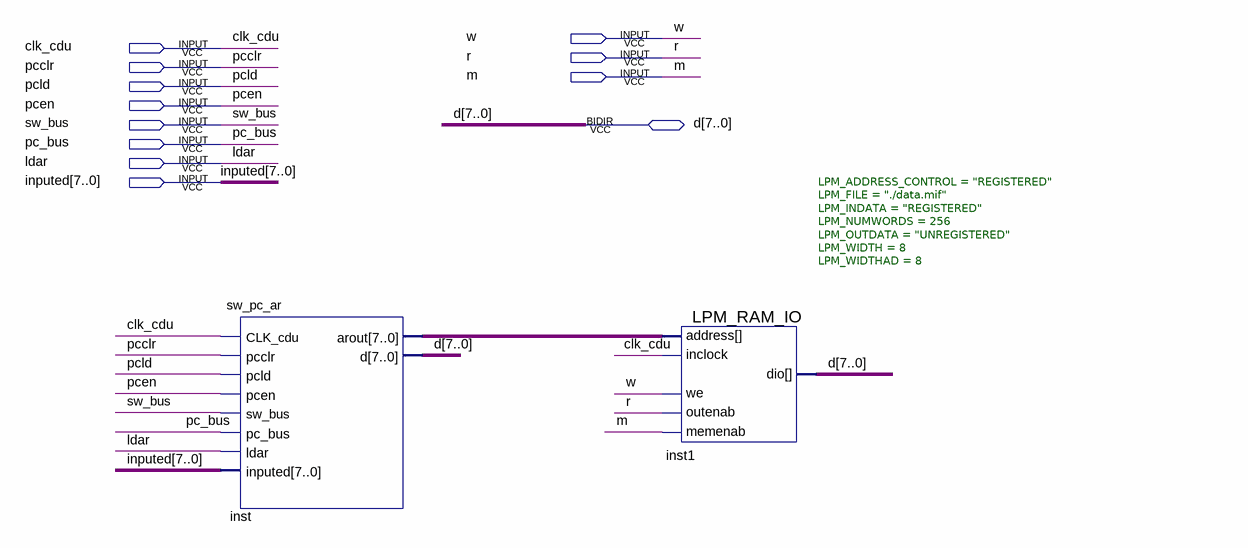
[diagram p0: schematic sheet]
// Quartus schematic ram1.bdf as structural Verilog: 2 symbols, 12 pins
module ram1 (
  input  w,
  input  clk_cdu,
  input  r,
  input  pcclr,
  input  m,
  input  pcld,
  input  pcen,
  input  sw_bus,
  input  pc_bus,
  input  ldar,
  input  [7:0] inputed,
  inout  [7:0] d
);

  wire [7:0] inst_arout;

  sw_pc_ar inst (
    .CLK_cdu(clk_cdu), .pcclr(pcclr), .pcld(pcld), .pcen(pcen), .sw_bus(sw_bus), .pc_bus(pc_bus),
    .ldar(ldar), .inputed(inputed), .arout(inst_arout), .d(d));
  LPM_RAM_IO #(.LPM_ADDRESS_CONTROL("REGISTERED"), .LPM_FILE("./data.mif"), .LPM_INDATA("REGISTERED"), .LPM_NUMWORDS(256), .LPM_OUTDATA("UNREGISTERED"), .LPM_WIDTH(8), .LPM_WIDTHAD(8)) inst1 (
    .address(inst_arout), .memenab(m), .inclock(clk_cdu), .we(w), .outenab(r), .dio(d));
endmodule
